# EAGLE schematic auxboxshield1.42 (EAGLE 6.5.0)
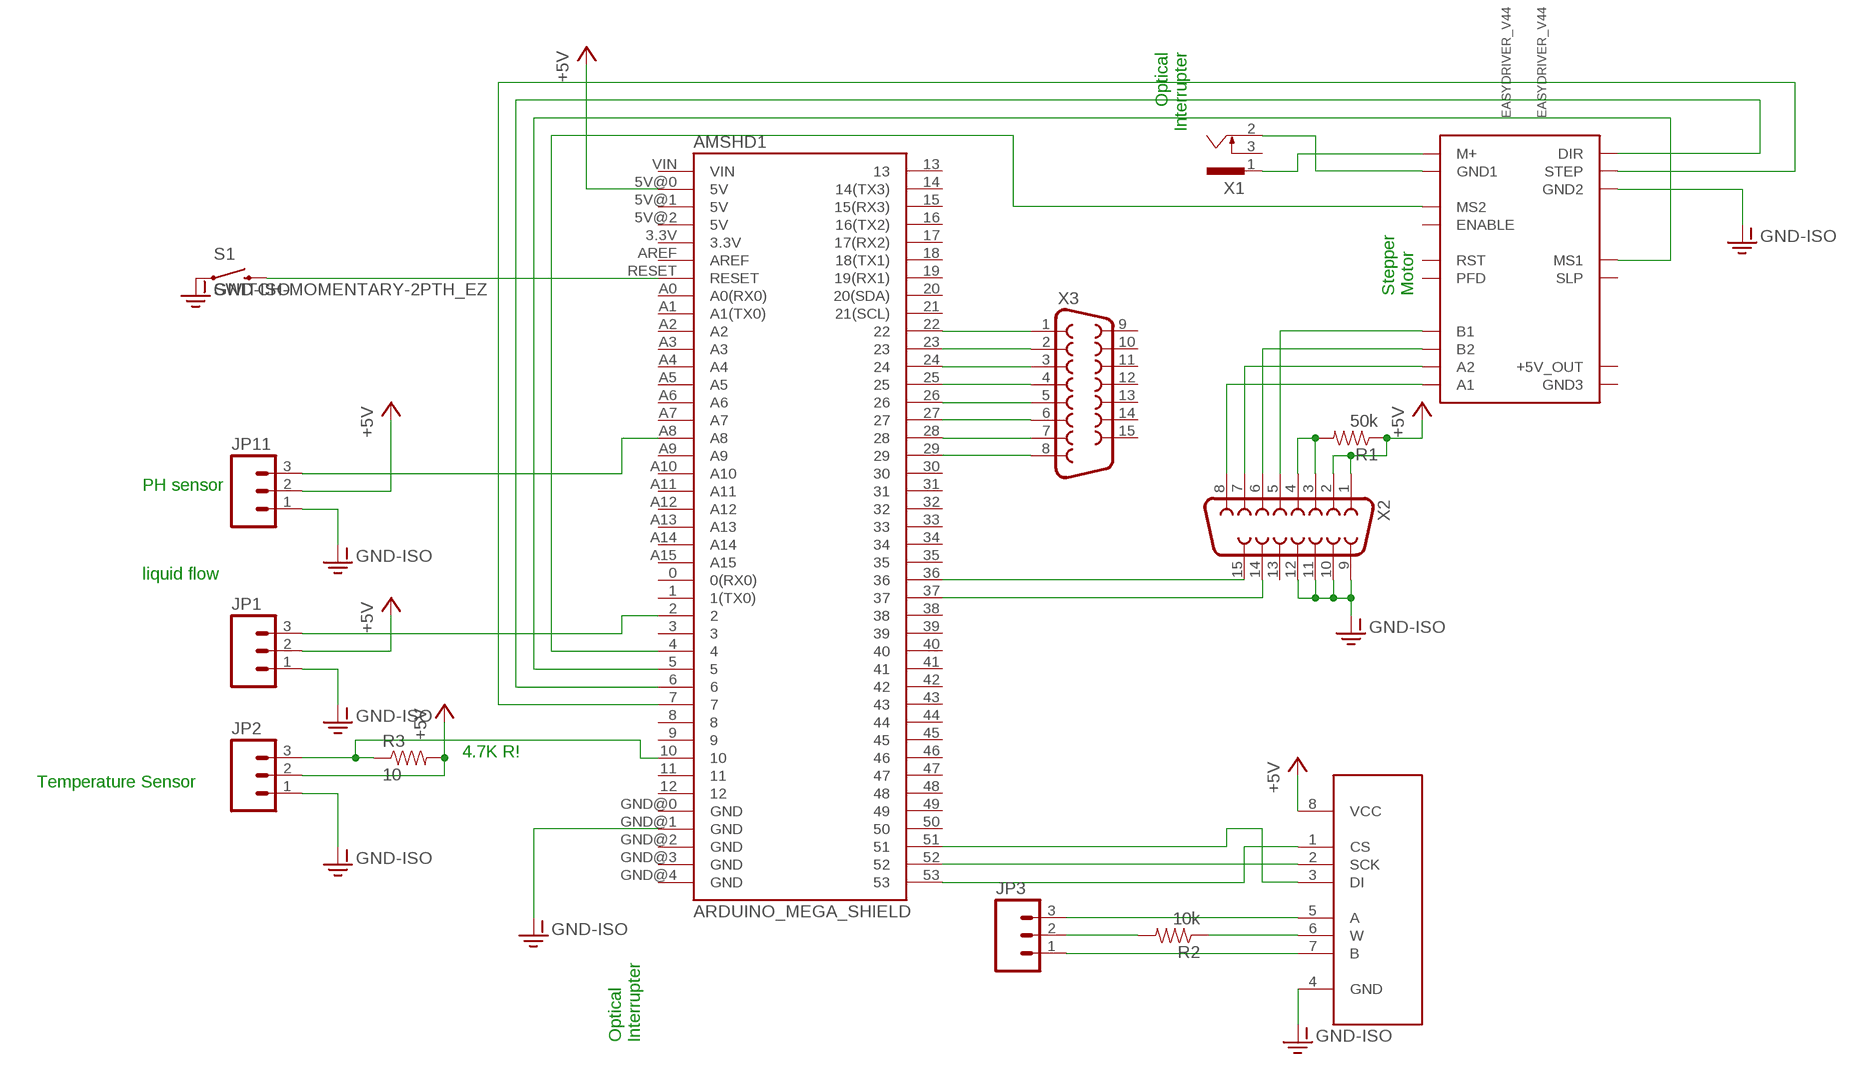
[diagram p0: schematic, sheet 1]

## Parts
AMSHD1  ARDUINO_MEGA_SHIELD  [ARDUINO_MEGA_SHIELD]
EASYDRIVER_V44  EASYDRIVER_V44  [EASYDRIVER_V44]
JP1  M03POLAR  [MOLEX-1X3]
JP2  M03POLAR  [MOLEX-1X3]
JP3  M03POLAR  [MOLEX-1X3]
JP11  M03POLAR  [MOLEX-1X3]
R1  50k  100KOHM-1/4W-5%(PTH)  [AXIAL-0.3]
R2  10k  10KOHM-1/4W-1%(PTH)HORIZ  [AXIAL-0.3]
R3  10  10OHM-1/4W-5%(PTH)  [AXIAL-0.3]
S1  SWITCH-MOMENTARY-2PTH_EZ  [TACTILE-PTH-EZ]
U2  MCP41XXXDIL  [DIL-08]
X1  SCD-014A  [SCD-014-A]
X2  F15HP  [F15HP]
X3  F15HP  [F15HP]

## Nets
+5V: AMSHD1.5V@0(5V) JP1.2 JP2.2 JP11.2 R1.P$1 R3.P$2 U2.8(VCC) X2.1 X2.2
GND-ISO: AMSHD1.GND@1(GND) EASYDRIVER_V44.GND2 JP1.1 JP2.1 JP11.1 S1.1 U2.4(GND) X2.9 X2.10 X2.11 X2.12
N$1: EASYDRIVER_V44.M+ X1.1
N$2: EASYDRIVER_V44.A1 X2.8
N$3: EASYDRIVER_V44.A2 X2.7
N$4: R1.P$2 X2.3 X2.4
N$5: AMSHD1.22 X3.1
N$6: EASYDRIVER_V44.GND1 X1.2
N$7: EASYDRIVER_V44.B2 X2.6
N$8: AMSHD1.23 X3.2
N$9: AMSHD1.RESET S1.3
N$10: AMSHD1.24 X3.3
N$11: EASYDRIVER_V44.B1 X2.5
N$12: AMSHD1.53 U2.1(CS)
N$13: AMSHD1.5 EASYDRIVER_V44.MS1
N$14: AMSHD1.25 X3.4
N$15: AMSHD1.A8 JP11.3
N$16: AMSHD1.4 EASYDRIVER_V44.MS2
N$17: AMSHD1.52 U2.2(SCK)
N$18: AMSHD1.26 X3.5
N$19: AMSHD1.27 X3.6
N$20: AMSHD1.51 U2.3(DI)
N$21: JP3.3 U2.5(A)
N$22: AMSHD1.28 X3.7
N$23: AMSHD1.29 X3.8
N$24: R2.P$1 U2.6(W)
N$25: JP3.2 R2.P$2
N$26: AMSHD1.10 JP2.3 R3.P$1
N$28: AMSHD1.2 JP1.3
N$29: AMSHD1.6 EASYDRIVER_V44.DIR
N$30: AMSHD1.7 EASYDRIVER_V44.STEP
N$32: JP3.1 U2.7(B)
N$33: AMSHD1.36 X2.15
N$34: AMSHD1.37 X2.14
Unconnected: AMSHD1.0(0(RX0)) AMSHD1.1(1(TX0)) AMSHD1.3 AMSHD1.3.3V AMSHD1.5V@1(5V) AMSHD1.5V@2(5V) AMSHD1.8 AMSHD1.9 AMSHD1.11 AMSHD1.12 AMSHD1.13 AMSHD1.14(14(TX3)) AMSHD1.15(15(RX3)) AMSHD1.16(16(TX2)) AMSHD1.17(17(RX2)) AMSHD1.18(18(TX1)) AMSHD1.19(19(RX1)) AMSHD1.20(20(SDA)) AMSHD1.21(21(SCL)) AMSHD1.30 AMSHD1.31 AMSHD1.32 AMSHD1.33 AMSHD1.34 AMSHD1.35 AMSHD1.38 AMSHD1.39 AMSHD1.40 AMSHD1.41 AMSHD1.42 AMSHD1.43 AMSHD1.44 AMSHD1.45 AMSHD1.46 AMSHD1.47 AMSHD1.48 AMSHD1.49 AMSHD1.50 AMSHD1.A0(A0(RX0)) AMSHD1.A1(A1(TX0)) AMSHD1.A2 AMSHD1.A3 AMSHD1.A4 AMSHD1.A5 AMSHD1.A6 AMSHD1.A7 AMSHD1.A9 AMSHD1.A10 AMSHD1.A11 AMSHD1.A12 AMSHD1.A13 AMSHD1.A14 AMSHD1.A15 AMSHD1.AREF AMSHD1.GND@0(GND) AMSHD1.GND@2(GND) AMSHD1.GND@3(GND) AMSHD1.GND@4(GND) AMSHD1.VIN EASYDRIVER_V44.ENABLE EASYDRIVER_V44.GND3 EASYDRIVER_V44.P$11(+5V_OUT) EASYDRIVER_V44.PFD EASYDRIVER_V44.RST EASYDRIVER_V44.SLEEP(SLP) X1.3 X2.13 X3.9 X3.10 X3.11 X3.12 X3.13 X3.14 X3.15

## Notes on the sheet
- Optical 
  Interrupter
- Stepper
  Motor
- PH sensor
- liquid flow
- 4.7K R!
- Temperature Sensor
- Optical 
  Interrupter

## Library data of the parts
AMSHD1 = SparkFun-Boards:ARDUINO_MEGA_SHIELD
EASYDRIVER_V44 = EasyDriver:EASYDRIVER_V44: EasyDriver version 4.4 - http://www.schmalzhaus.com/EasyDriver
JP1-JP3 JP11 = SparkFun-Connectors:M03: Header 3 Standard 3-pin 0.1" header. Use with straight break away headers (SKU : PRT-00116), right angle break away headers (PRT-00553), swiss pins (PRT-00743), machine pins (PRT-00117), and female headers (PRT-00115). Molex polarized connector foot print use with SKU : PRT-08232 with associated crimp pins and housings.
R1 = SparkFun-Resistors:100KOHM-1/4W-5%(PTH): RES-10686; PROD_ID: RES-10686; VALUE: 100k
R2 = SparkFun-Resistors:10KOHM-1/4W-1%(PTH): RES-12183; PROD_ID: RES-12183
R3 = SparkFun-Resistors:10OHM-1/4W-5%(PTH): RES-10698; PROD_ID: RES-10698
S1 = SparkFun-Electromechanical:SWITCH-MOMENTARY-2: Various NO switches- pushbuttons, reed, etc
U2 = SparkFun-AnalogIC:MCP41XXX: SPI controlled single digital potentiometer by Microchip PID: COM-10613
X1 = con-shiua-chyuan:SCD-014A: Power Jack 2.5mm; OC_FARNELL: unknown; OC_NEWARK: unknown
X2 X3 = con-subd:F15: SUB-D; OC_FARNELL: unknown; OC_NEWARK: unknown